# Altium schematic sheet ZYNQ400-MIO.SchDoc
size A3
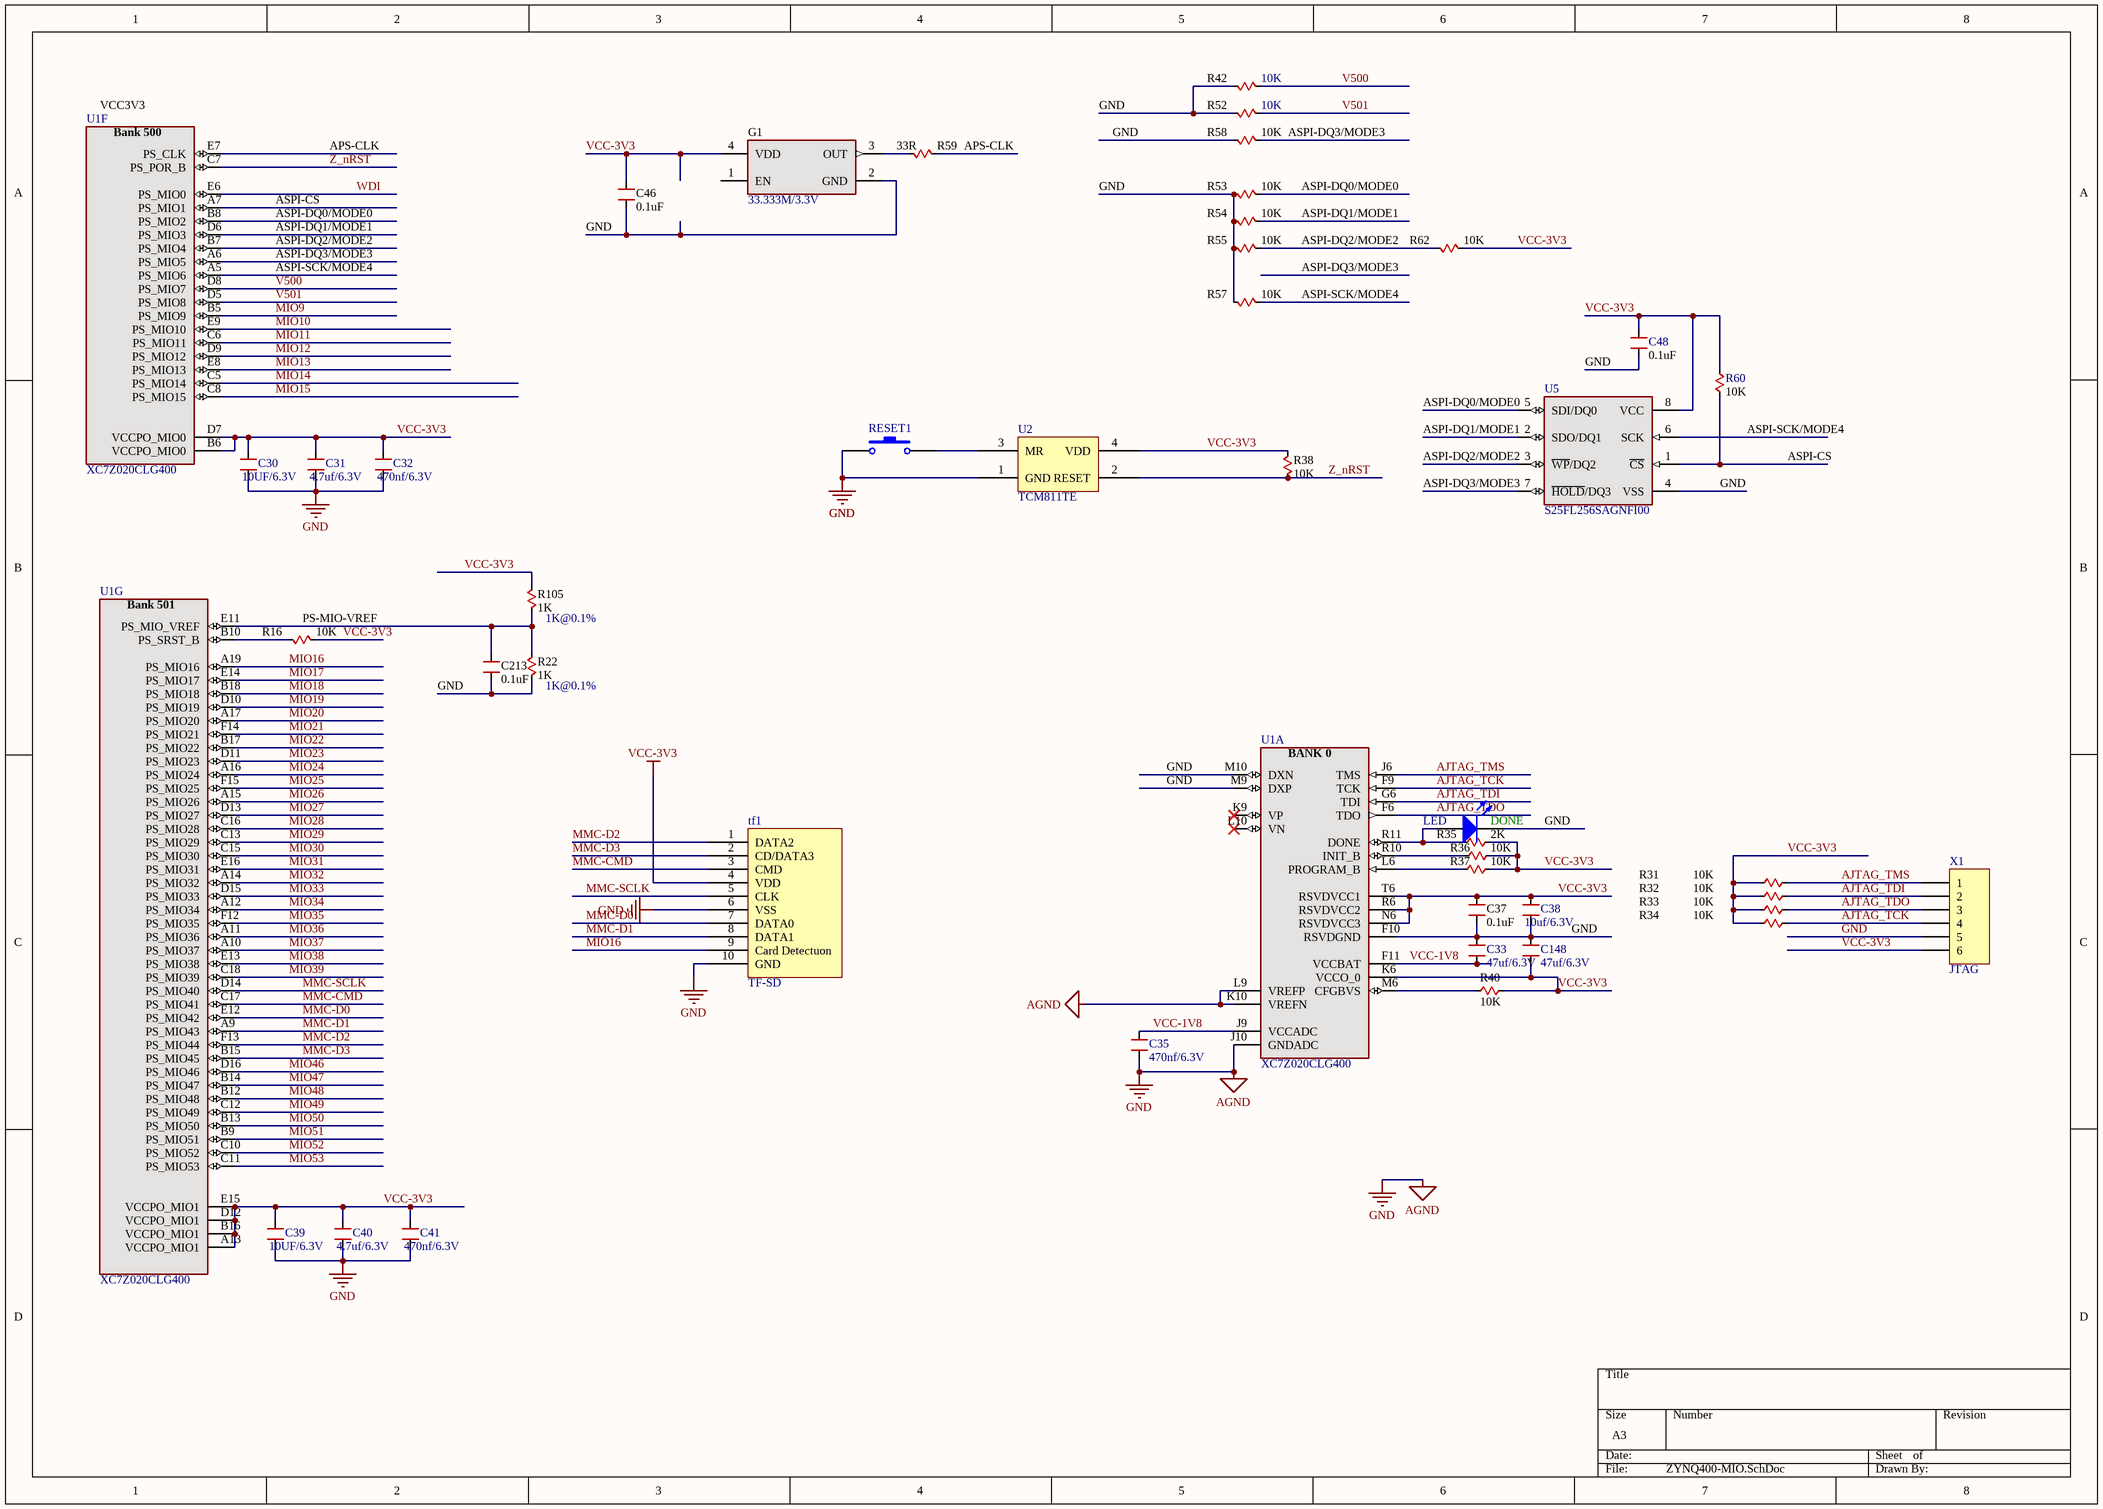
[diagram p0: ZYNQ400-MIO.SchDoc]

## Parts
C30  10UF/6.3V  [0402]
C31  4.7uf/6.3V  [0402]
C32  470nf/6.3V  [0402]
C33  47uf/6.3V  [0402]
C35  470nf/6.3V  [0402]
C37  0.1UF  [0402]
C38  10uf/6.3V  [0603]
C39  10UF/6.3V  [0402]
C40  4.7uf/6.3V  [0402]
C41  470nf/6.3V  [0402]
C46  0.1UF  [0402]
C48  0.1UF  [0402]
C148  47uf/6.3V  [0402]
C213  0.1uF  [0402]
DONE  LED  [D0402]
G1  33.333M/3.3V  [3.2*2.5]
R16  10K  [0402]
R22  1K@0.1%  value 1K  [0402]
R31  10K  [0402]
R32  10K  [0402]
R33  10K  [0402]
R34  10K  [0402]
R35  value 2K  [0402]  (hidden comment: 1K)
R36  10K  [0402]
R37  10K  [0402]
R38  10K  [0402]
R40  10K  [0402]
R42  10K  [0402]
R52  10K  [0402]
R53  10K  [0402]
R54  10K  [0402]
R55  10K  [0402]
R57  10K  [0402]
R58  10K  [0402]
R59  33R  [0402]
R60  10K  [0402]
R62  10K  [0402]
R105  1K@0.1%  value 1K  [0402]
RESET1  SW-PB  [micro button_2_SMD]  (value not drawn)
tf1  TF-SD  [TF]
U1  XC7Z020CLG400  [CLG400]  (parts A,F,G of 9)
U2  TCM811TE  [TCM811TERCTR]
U5  S25FL256SAGNFI00  [MLP8]
X1  JTAG  [1.27*6]

## Nets
GND: C30.2 C31.2 C32.2 C33.2 C35.2 C37.2 C38.2 C39.2 C40.2 C41.2 C46.2 C48.2 C148.2 C213.2 DONE.2(K) G1.2(GND) R22.2 R42.1 R52.1 R53.1 R54.1 R55.1 R57.1 R58.1 RESET1.1 tf1.6(VSS) tf1.10(GND) U1.F10(RSVDGND) U1.J10(GNDADC) U1.K10(VREFN) U1.L9(VREFP) U1.M9(DXP) U1.M10(DXN) U2.1(GND) U5.4(VSS) X1.5  [also labelled AGND]
VCC-3V3: C30.1 C31.1 C32.1 C37.1 C38.1 C39.1 C40.1 C41.1 C46.1 C48.1 C148.1 G1.4(VDD) R16.2 R31.1 R32.1 R33.1 R34.1 R35.2 R36.1 R37.2 R38.2 R40.2 R60.1 R62.2 R105.1 tf1.4(VDD) U1.A13(VCCPO_MIO1) U1.B6(VCCPO_MIO0) U1.B16(VCCPO_MIO1) U1.D7(VCCPO_MIO0) U1.D12(VCCPO_MIO1) U1.E15(VCCPO_MIO1) U1.K6(VCCO_0) U1.N6(RSVDVCC3) U1.R6(RSVDVCC2) U1.T6(RSVDVCC1) U2.4(VDD) U5.8(VCC) X1.6
AJTAG_TCK: R34.2 U1.F9(TCK) X1.4
AJTAG_TDI: R32.2 U1.G6(TDI) X1.2
AJTAG_TDO: R33.2 U1.F6(TDO) X1.3
AJTAG_TMS: R31.2 U1.J6(TMS) X1.1
APS-CLK: R59.2 U1.E7(PS_CLK)
ASPI-CS: R60.2 U1.A7(PS_MIO1) U5.1(~{CS})
ASPI-DQ0/MODE0: R53.2 U1.B8(PS_MIO2) U5.5(SDI/DQ0)
ASPI-DQ1/MODE1: R54.2 U1.D6(PS_MIO3) U5.2(SDO/DQ1)
ASPI-DQ2/MODE2: R55.2 R62.1 U1.B7(PS_MIO4) U5.3(~{WP}/DQ2)
ASPI-DQ3/MODE3: R58.2 U1.A6(PS_MIO5) U5.7(~{HOLD}/DQ3)
ASPI-SCK/MODE4: R57.2 U1.A5(PS_MIO6) U5.6(SCK)
MIO9: U1.B5(PS_MIO9)
MIO10: U1.E9(PS_MIO10)
MIO11: U1.C6(PS_MIO11)
MIO12: U1.D9(PS_MIO12)
MIO13: U1.E8(PS_MIO13)
MIO14: U1.C5(PS_MIO14)
MIO15: U1.C8(PS_MIO15)
MIO16: tf1.9(Card_Detectuon) U1.A19(PS_MIO16)
MIO17: U1.E14(PS_MIO17)
MIO18: U1.B18(PS_MIO18)
MIO19: U1.D10(PS_MIO19)
MIO20: U1.A17(PS_MIO20)
MIO21: U1.F14(PS_MIO21)
MIO22: U1.B17(PS_MIO22)
MIO23: U1.D11(PS_MIO23)
MIO24: U1.A16(PS_MIO24)
MIO25: U1.F15(PS_MIO25)
MIO26: U1.A15(PS_MIO26)
MIO27: U1.D13(PS_MIO27)
MIO28: U1.C16(PS_MIO28)
MIO29: U1.C13(PS_MIO29)
MIO30: U1.C15(PS_MIO30)
MIO31: U1.E16(PS_MIO31)
MIO32: U1.A14(PS_MIO32)
MIO33: U1.D15(PS_MIO33)
MIO34: U1.A12(PS_MIO34)
MIO35: U1.F12(PS_MIO35)
MIO36: U1.A11(PS_MIO36)
MIO37: U1.A10(PS_MIO37)
MIO38: U1.E13(PS_MIO38)
MIO39: U1.C18(PS_MIO39)
MIO46: U1.D16(PS_MIO46)
MIO47: U1.B14(PS_MIO47)
MIO48: U1.B12(PS_MIO48)
MIO49: U1.C12(PS_MIO49)
MIO50: U1.B13(PS_MIO50)
MIO51: U1.B9(PS_MIO51)
MIO52: U1.C10(PS_MIO52)
MIO53: U1.C11(PS_MIO53)
MMC-CMD: tf1.3(CMD) U1.C17(PS_MIO41)
MMC-D0: tf1.7(DATA0) U1.E12(PS_MIO42)
MMC-D1: tf1.8(DATA1) U1.A9(PS_MIO43)
MMC-D2: tf1.1(DATA2) U1.F13(PS_MIO44)
MMC-D3: tf1.2(CD/DATA3) U1.B15(PS_MIO45)
MMC-SCLK: tf1.5(CLK) U1.D14(PS_MIO40)
PS-MIO-VREF: C213.1 R22.1 R105.2 U1.E11(PS_MIO_VREF)
V500: R42.2 U1.D8(PS_MIO7)
V501: R52.2 U1.D5(PS_MIO8)
VCC-1V8: C33.1 C35.1 U1.F11(VCCBAT) U1.J9(VCCADC)
WDI: U1.E6(PS_MIO0)
Z_nRST: R38.1 U1.C7(PS_POR_B) U2.2(RESET)
NetDONE_1: DONE.1(A) R35.1 U1.R11(DONE)
NetG1_3: G1.3(OUT) R59.1
NetR16_1: R16.1 U1.B10(PS_SRST_B)
NetR36_2: R36.2 U1.R10(INIT_B)
NetR37_1: R37.1 U1.L6(PROGRAM_B)
NetR40_1: R40.1 U1.M6(CFGBVS)
NetRESET1_2: RESET1.2 U2.3(MR)

Not connected (* = marked no-connect by the designer): G1 1(EN); U1 K9(VP)* L10(VN)*

## Notes on the sheet
- VCC3V3
- (in symbol XC7Z020-CLG400, part A) BANK 0
- (in symbol XC7Z020-CLG400, part F) Bank 500
- (in symbol XC7Z020-CLG400, part G) Bank 501

## Library data of the parts
C30-C33 C35 C37-C41 C46 C48 C148 C213 = CAPACITOR: Generic Capacitor; DPN: *; Manufacturer: *
  C37 C46 C48 C213: Value: 0.1uF
DONE = LED0: Typical INFRARED GaAs LED; Published: 8-Jun-2000; LatestRevisionDate: 08-Jul-2005; LatestRevisionNote: Mech Layer 1 removed.; PackageReference: LED-0; Publisher: Altium Limited; PackageDescription: LED; 2 Leads
G1 = FXO-HC5: 3.3V HCMOS Oscillator; Manufacturer: Fox Electronics; Value: 33.33MHz; DPN: *
R16 R22 R31-R38 R40 R42 R52-R55 R57-R60 R62 R105 = RESISTOR: Generic Resistor; Manufacturer: *; DPN: *
  R16 R31-R34 R36-R38 R40 R42 R52-R55 R57 R58 R60 R62: Value: 10K
  R59: Value: 33R
RESET1 = SW-PB: Switch; Published: 24-Mar-1999; LatestRevisionDate: 17-Jul-2002; LatestRevisionNote: Re-released for DXP Platform.; PackageReference: SPST-2; Publisher: Altium Limited; PackageDescription: Switch; 2 Leads
U1 = XC7Z020-CLG400: Zynq 7000 FPGA 20 Die, in a CSG 484 Package; Manufacturer: Xilinx; DPN: *; Die: *
U5 = N25Q12-F8: Serial Flash Memory, 16Mbit, Low Voltage, 50MHz SPI Bus Interface; Manufacturer: Spansion; DPN: *
X1 = Header 6: Header, 6-Pin; LatestRevisionDate: 17-Jul-2002; LatestRevisionNote: Re-released for DXP Platform.; Publisher: Altium Limited
tf1 = TF-SD: Parameter 1: *